# Altium schematic sheet converter.schdoc: CVT
size A4; Date: 08.29.2026; CheckedBy: azhaoii; DrawnBy: miaow; Revision: v1.0.0; SheetNumber: 1; SheetTotal: 3; Sample: A0; Url: github.com/miaow-cn/pwrhub-hw; Liscense: CC-BY-SA-4.0; Board: Power Hub; BoardType: MAIN; Desc: 6 channel buck
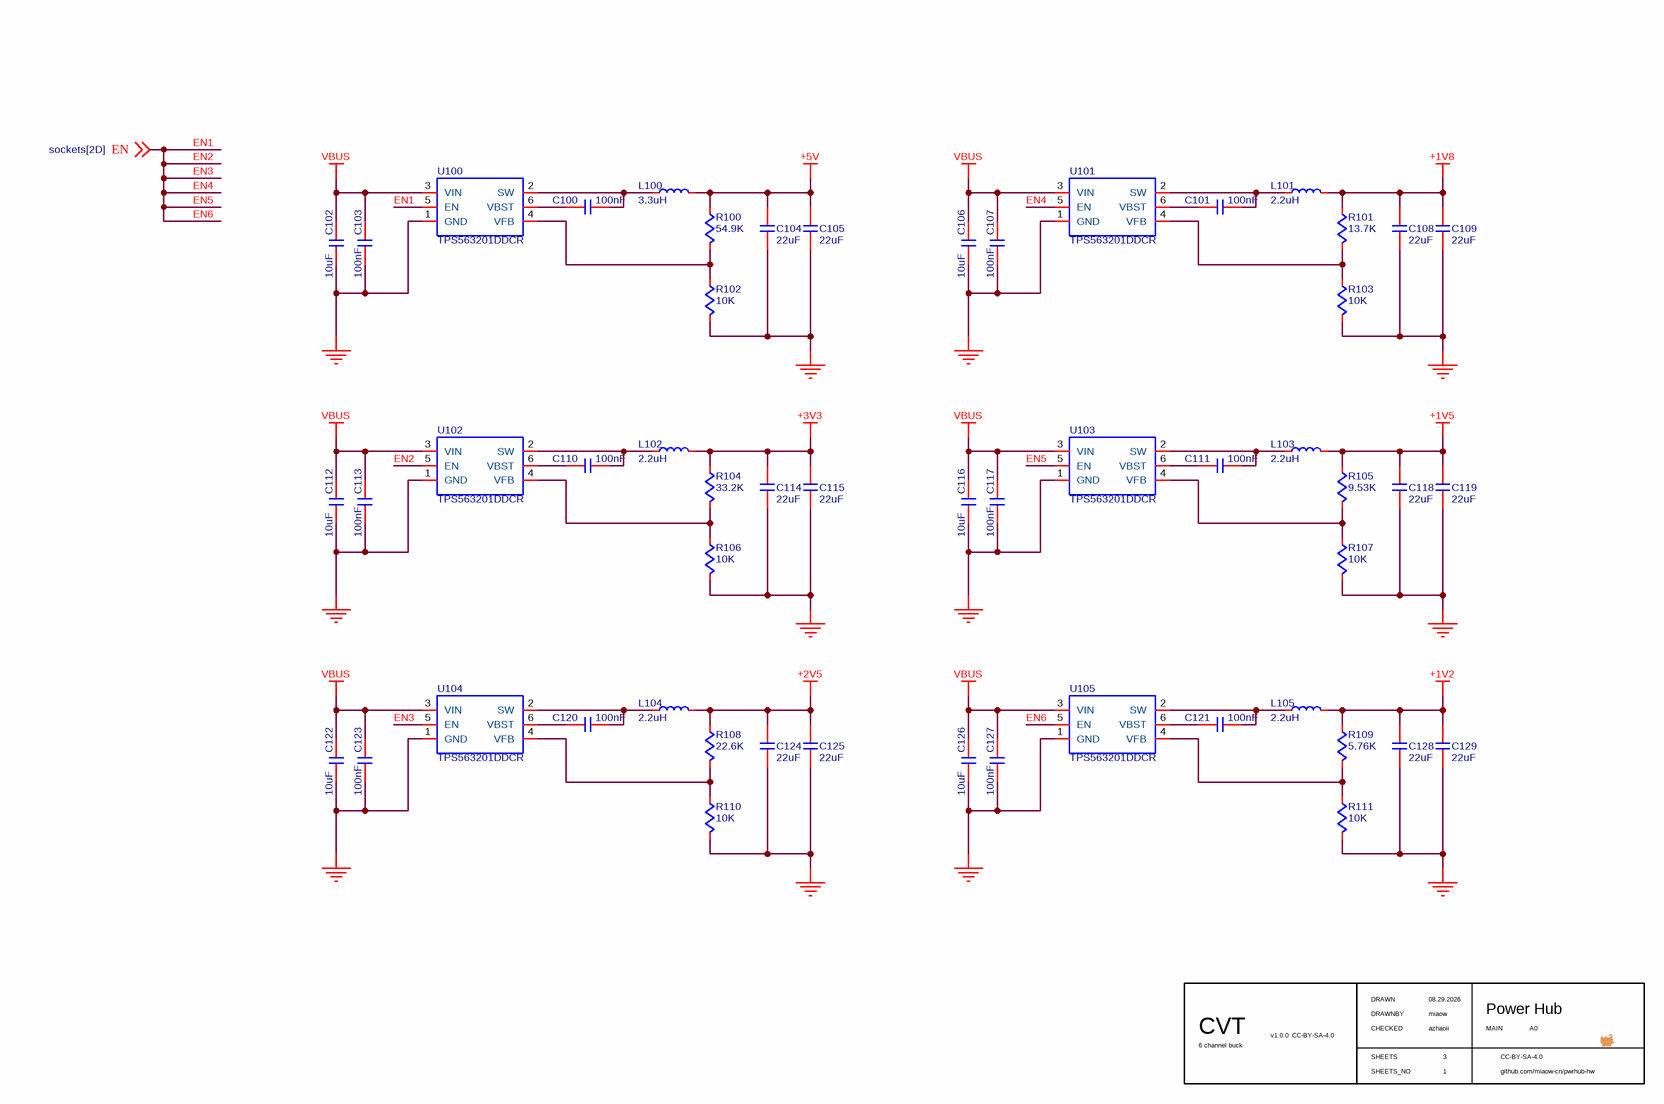
[diagram p0: converter.schdoc]

## Parts
C100  value 100nF  [C0402]  (hidden comment: C-NOMO)
C101  value 100nF  [C0402]  (hidden comment: C-NOMO)
C102  value 10uF  [C0805]  (hidden comment: C-NOMO)
C103  value 100nF  [C0402]  (hidden comment: C-NOMO)
C104  value 22uF  [C0805]  (hidden comment: C-NOMO)
C105  value 22uF  [C0805]  (hidden comment: C-NOMO)
C106  value 10uF  [C0805]  (hidden comment: C-NOMO)
C107  value 100nF  [C0402]  (hidden comment: C-NOMO)
C108  value 22uF  [C0805]  (hidden comment: C-NOMO)
C109  value 22uF  [C0805]  (hidden comment: C-NOMO)
C110  value 100nF  [C0402]  (hidden comment: C-NOMO)
C111  value 100nF  [C0402]  (hidden comment: C-NOMO)
C112  value 10uF  [C0805]  (hidden comment: C-NOMO)
C113  value 100nF  [C0402]  (hidden comment: C-NOMO)
C114  value 22uF  [C0805]  (hidden comment: C-NOMO)
C115  value 22uF  [C0805]  (hidden comment: C-NOMO)
C116  value 10uF  [C0805]  (hidden comment: C-NOMO)
C117  value 100nF  [C0402]  (hidden comment: C-NOMO)
C118  value 22uF  [C0805]  (hidden comment: C-NOMO)
C119  value 22uF  [C0805]  (hidden comment: C-NOMO)
C120  value 100nF  [C0402]  (hidden comment: C-NOMO)
C121  value 100nF  [C0402]  (hidden comment: C-NOMO)
C122  value 10uF  [C0805]  (hidden comment: C-NOMO)
C123  value 100nF  [C0402]  (hidden comment: C-NOMO)
C124  value 22uF  [C0805]  (hidden comment: C-NOMO)
C125  value 22uF  [C0805]  (hidden comment: C-NOMO)
C126  value 10uF  [C0805]  (hidden comment: C-NOMO)
C127  value 100nF  [C0402]  (hidden comment: C-NOMO)
C128  value 22uF  [C0805]  (hidden comment: C-NOMO)
C129  value 22uF  [C0805]  (hidden comment: C-NOMO)
L100  value 3.3uH  [FXL0530]  (hidden comment: L)
L101  value 2.2uH  [FXL0420]  (hidden comment: L)
L102  value 2.2uH  [FXL0420]  (hidden comment: L)
L103  value 2.2uH  [FXL0420]  (hidden comment: L)
L104  value 2.2uH  [FXL0420]  (hidden comment: L)
L105  value 2.2uH  [FXL0420]  (hidden comment: L)
R100  value 54.9K  [R0402]  (hidden comment: R)
R101  value 13.7K  [R0402]  (hidden comment: R)
R102  value 10K  [R0402]  (hidden comment: R)
R103  value 10K  [R0402]  (hidden comment: R)
R104  value 33.2K  [R0402]  (hidden comment: R)
R105  value 9.53K  [R0402]  (hidden comment: R)
R106  value 10K  [R0402]  (hidden comment: R)
R107  value 10K  [R0402]  (hidden comment: R)
R108  value 22.6K  [R0402]  (hidden comment: R)
R109  value 5.76K  [R0402]  (hidden comment: R)
R110  value 10K  [R0402]  (hidden comment: R)
R111  value 10K  [R0402]  (hidden comment: R)
U100  TPS563201DDCR  [TPS563201DDCR]
U101  TPS563201DDCR  [TPS563201DDCR]
U102  TPS563201DDCR  [TPS563201DDCR]
U103  TPS563201DDCR  [TPS563201DDCR]
U104  TPS563201DDCR  [TPS563201DDCR]
U105  TPS563201DDCR  [TPS563201DDCR]

## Nets
+1V2: C128.2 C129.2 L105.2 R109.2
+1V5: C118.2 C119.2 L103.2 R105.2
+1V8: C108.2 C109.2 L101.2 R101.2
+2V5: C124.2 C125.2 L104.2 R108.2
+3V3: C114.2 C115.2 L102.2 R104.2
+5V: C104.2 C105.2 L100.2 R100.2
GND: C102.1 C103.1 C104.1 C105.1 C106.1 C107.1 C108.1 C109.1 C112.1 C113.1 C114.1 C115.1 C116.1 C117.1 C118.1 C119.1 C122.1 C123.1 C124.1 C125.1 C126.1 C127.1 C128.1 C129.1 R102.1 R103.1 R106.1 R107.1 R110.1 R111.1 U100.1(GND) U101.1(GND) U102.1(GND) U103.1(GND) U104.1(GND) U105.1(GND)
VBUS: C102.2 C103.2 C106.2 C107.2 C112.2 C113.2 C116.2 C117.2 C122.2 C123.2 C126.2 C127.2 U100.3(VIN) U101.3(VIN) U102.3(VIN) U103.3(VIN) U104.3(VIN) U105.3(VIN)
EN1: U100.5(EN) U101.5(EN) U102.5(EN) U103.5(EN) U104.5(EN) U105.5(EN) ; off-sheet EN  [also labelled EN, EN2, EN3, EN4, EN5, EN6]
NetC100_1: C100.1 U100.6(VBST)
NetC100_2: C100.2 L100.1 U100.2(SW)
NetC101_1: C101.1 U101.6(VBST)
NetC101_2: C101.2 L101.1 U101.2(SW)
NetC110_1: C110.1 U102.6(VBST)
NetC110_2: C110.2 L102.1 U102.2(SW)
NetC111_1: C111.1 U103.6(VBST)
NetC111_2: C111.2 L103.1 U103.2(SW)
NetC120_1: C120.1 U104.6(VBST)
NetC120_2: C120.2 L104.1 U104.2(SW)
NetC121_1: C121.1 U105.6(VBST)
NetC121_2: C121.2 L105.1 U105.2(SW)
NetR100_1: R100.1 R102.2 U100.4(VFB)
NetR101_1: R101.1 R103.2 U101.4(VFB)
NetR104_1: R104.1 R106.2 U102.4(VFB)
NetR105_1: R105.1 R107.2 U103.4(VFB)
NetR108_1: R108.1 R110.2 U104.4(VFB)
NetR109_1: R109.1 R111.2 U105.4(VFB)

## Notes on the sheet
- DRAWN
- CHECKED
- DRAWNBY
- SHEETS
- SHEETS_NO

## Library data of the parts
C100-C129 = C-NOMO: voltage: 25V; precision: 5%
L100-L105 = L: Code_IEC: 1005; Published: 8-Jun-2000; LatestRevisionDate: 29-May-2009; LatestRevisionNote: IPC-7351 Footprint Added.; PackageReference: 0402-A; Publisher: Altium Limited; PackageDescription: Chip Inductor; Code_JEITA: 0402; Supplier 1: LCSC
  L100: Supplier Part Number 1: C475518
  L101-L105: Supplier Part Number 1: C167206
R100-R111 = R: precision: 1%
U100-U105 = TPS563201DDCR: BUCK; Supplier 1: LCSC; Supplier Part Number 1: C116592